# EAGLE design IV_Swinger_2_ss_mod (EAGLE 9.2.1)
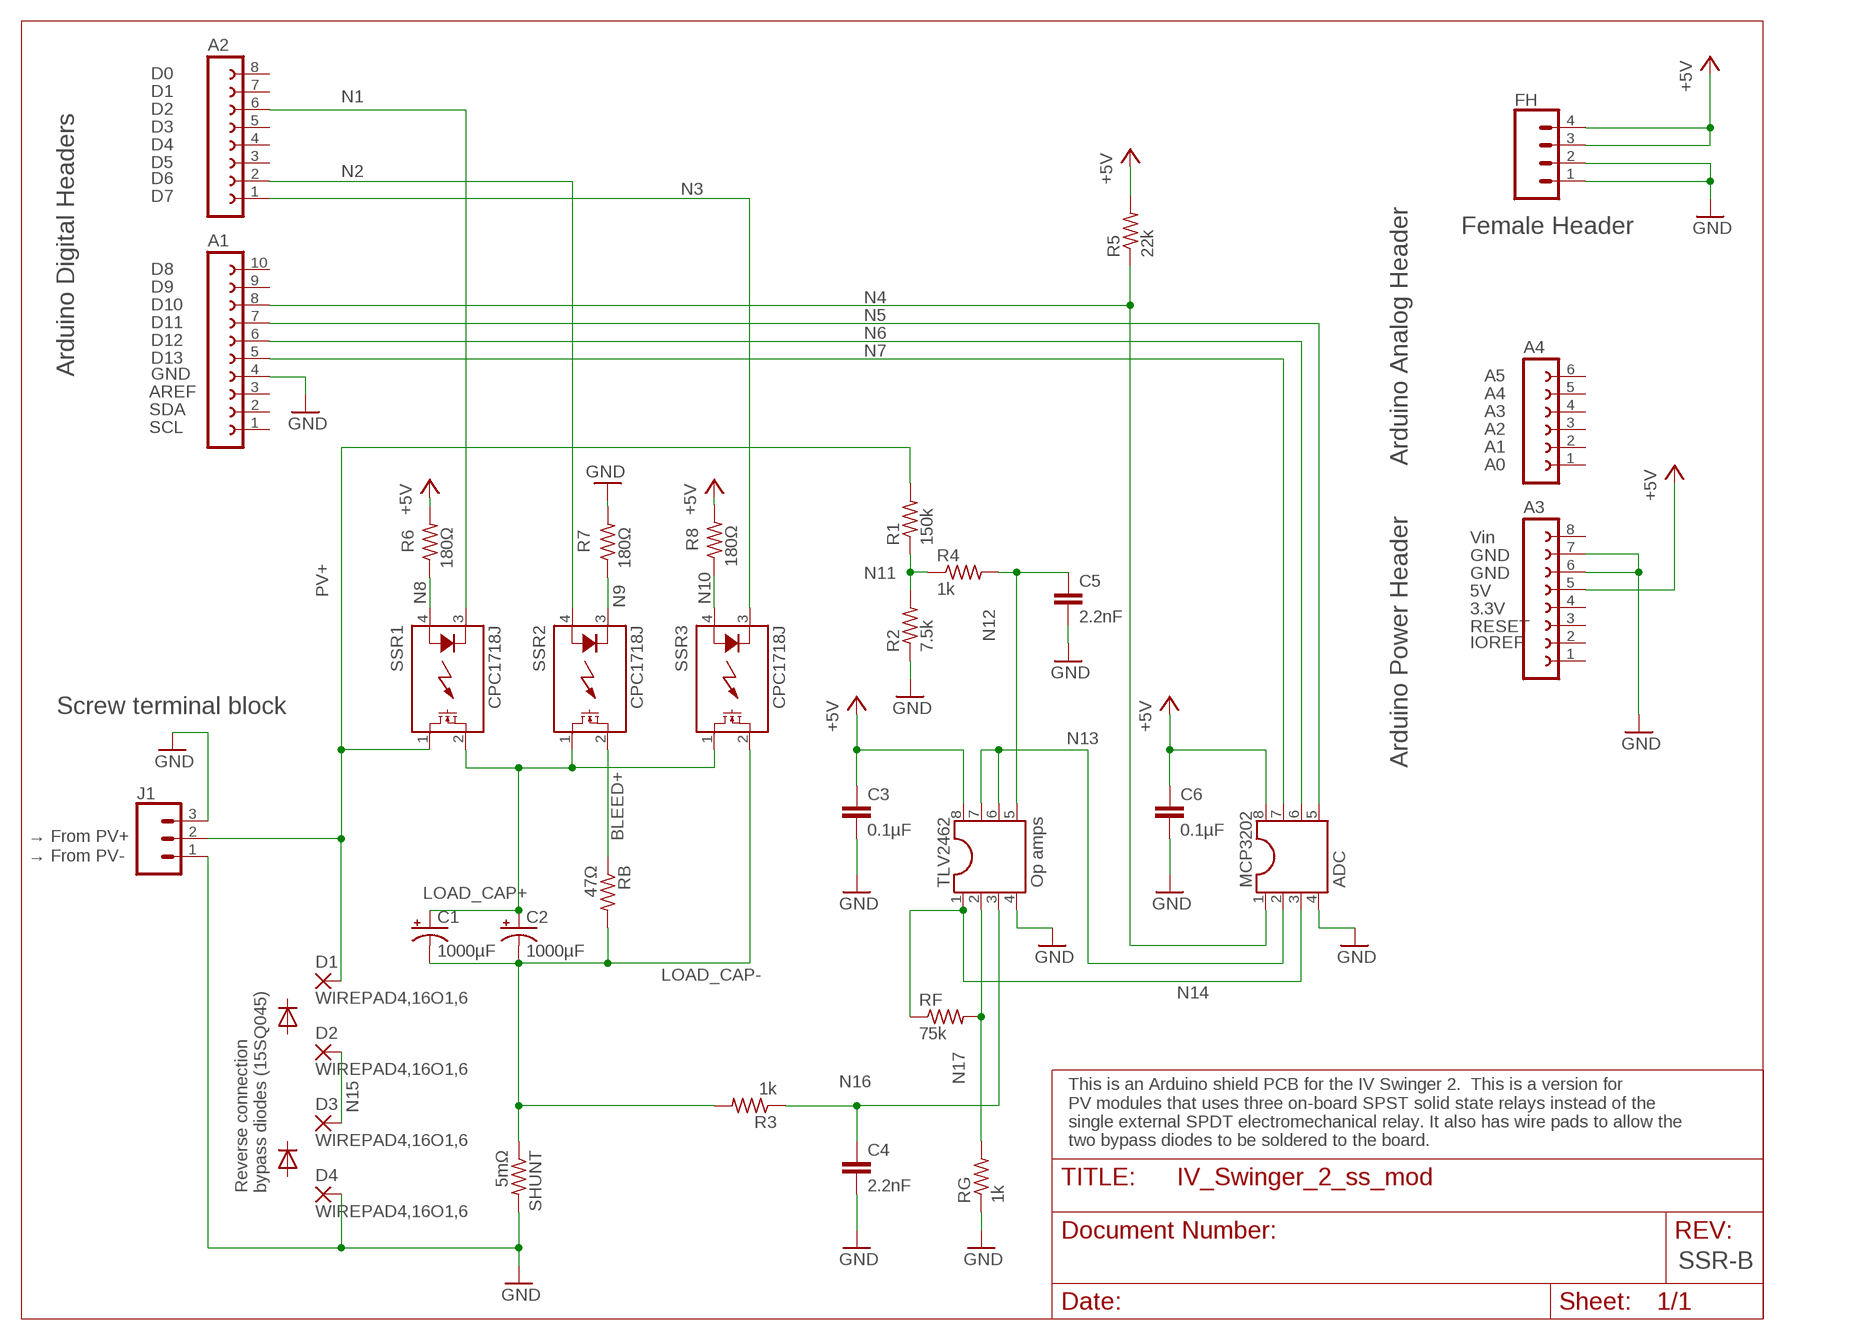
[diagram p0: schematic, sheet 1]

## Parts
A1  FE10-1  [FE10]
A2  FE08-1  [FE08]
A3  FE08-1  [FE08]
A4  FE06-1  [FE06]
C1  1000µF  CPOL-USE7.5-18  [E7,5-18]
C2  1000µF  CPOL-USE7.5-18  [E7,5-18]
C3  0.1µF  C-EU025-030X050  [C025-030X050]
C4  2.2nF  C-EU025-030X050  [C025-030X050]
C5  2.2nF  C-EU025-030X050  [C025-030X050]
C6  0.1µF  C-EU025-030X050  [C025-030X050]
D1  WIREPAD4,16O1,6  [4,16O1,6]
D2  WIREPAD4,16O1,6  [4,16O1,6]
D3  WIREPAD4,16O1,6  [4,16O1,6]
D4  WIREPAD4,16O1,6  [4,16O1,6]
FH  CONN_04LONGPADS  [1X04_LONGPADS]
J1  CONN_03-SCREW-5MM  [SCREWTERMINAL-5MM-3]
MCP3202  ADC  DIL8S  [SOCKET-08]
R1  150k  R-US_0207/10  [0207/10]
R2  7.5k  R-US_0207/10  [0207/10]
R3  1k  R-US_0207/10  [0207/10]
R4  1k  R-US_0207/10  [0207/10]
R5  22k  R-US_0207/10  [0207/10]
R6  180Ω  R-US_0207/10  [0207/10]
R7  180Ω  R-US_0207/10  [0207/10]
R8  180Ω  R-US_0207/10  [0207/10]
RB  47Ω  R-US_0817/7V  [P0817V]
RF  75k  R-US_0207/10  [0207/10]
RG  1k  R-US_0207/10  [0207/10]
SHUNT  5mΩ  R-US_0617/5V  [0617V]
SSR1  CPC1718J  [I4-PAC]
SSR2  CPC1718J  [I4-PAC]
SSR3  CPC1718J  [I4-PAC]
TLV2462  Op amps  DIL8S  [SOCKET-08]

## Nets
+5V: A3.5 C3.1 C6.1 FH.3 FH.4 MCP3202.8 R5.2 R6.2 R8.2 TLV2462.8
BLEED+: RB.1 SSR2.2(DS2)
GND: A1.4 A3.6 A3.7 C3.2 C4.2 C5.2 C6.2 D4.1(P) FH.1 FH.2 J1.1 J1.3 MCP3202.4 R2.1 R7.2 RG.1 SHUNT.2 TLV2462.4
LOAD_CAP+: C1.+ C2.+ SSR1.2(DS2) SSR2.1(DS1) SSR3.1(DS1)
LOAD_CAP-: C1.- C2.- R3.2 RB.2 SHUNT.1 SSR3.2(DS2)
N1: A2.6 SSR1.3(K)
N2: A2.2 SSR2.4(A)
N3: A2.1 SSR3.3(K)
N4: A1.8 MCP3202.1 R5.1
N5: A1.7 MCP3202.5
N6: A1.6 MCP3202.6
N7: A1.5 MCP3202.7
N8: R6.1 SSR1.4(A)
N9: R7.1 SSR2.3(K)
N10: R8.1 SSR3.4(A)
N11: R1.1 R2.2 R4.1
N12: C5.1 R4.2 TLV2462.5
N13: MCP3202.2 TLV2462.6 TLV2462.7
N14: MCP3202.3 RF.1 TLV2462.1
N15: D2.1(P) D3.1(P)
N16: C4.1 R3.1 TLV2462.3
N17: RF.2 RG.2 TLV2462.2
PV+: D1.1(P) J1.2 R1.2 SSR1.1(DS1)
Unconnected: A1.1 A1.2 A1.3 A1.9 A1.10 A2.3 A2.4 A2.5 A2.7 A2.8 A3.1 A3.2 A3.3 A3.4 A3.8 A4.1 A4.2 A4.3 A4.4 A4.5 A4.6

## Notes on the sheet
- D0
- D1
- D2
- D3
- D4
- D5
- D6
- D7
- Female Header
- D8
- D9
- D10
- D11
- D12
- D13
- Arduino Digital Headers | GND
- A5
- AREF | A4
- SDA | A3
- SCL | A2
- A1
- Arduino Analog Header
- A0
- Vin
- GND
- GND
- 5V
- 3.3V
- RESET
- IOREF
- Screw terminal block
- Arduino Power Header
- → From PV+
- → From PV-
- This is an Arduino shield PCB for the IV Swinger 2.  This is a version for 
  PV modules that uses three on-board SPST solid state relays instead of the 
  single external SPDT electromechanical relay. It also has wire pads to allow the 
  two bypass diodes to be soldered to the board.
- Reverse connection
  bypass diodes (15SQ045)
- SSR-B

## Library data of the parts
A1 = con-lsta:FE10-1: FEMALE HEADER; OC_FARNELL: unknown; OC_NEWARK: unknown
A2 A3 = con-lsta:FE08-1: FEMALE HEADER; OC_FARNELL: unknown; OC_NEWARK: unknown
A4 = con-lsta:FE06-1: FEMALE HEADER; OC_FARNELL: unknown; OC_NEWARK: unknown
C1 C2 = rcl:CPOL-US: POLARIZED CAPACITOR, American symbol; SPICEPREFIX: C
C3-C6 = rcl:C-EU: CAPACITOR, European symbol; SPICEPREFIX: C
D1 = wirepad:WIREPAD: Wire PAD connect wire on PCB; SPICEPREFIX: X
D2-D4 = wirepad:WIREPAD: Wire PAD connect wire on PCB
FH = my_connectors:CONN_04: Multi connection point. Often used as Generic Header-pin footprint for 0.1 inch spaced/style header connections On any of the 0.1 inch spaced packages, you can populate with these: Break Away Headers - Straight <https://www.sparkfun.com/products/116> (PRT-00116) Break Away Male Headers - Right Angle <https://www.sparkfun.com/products/553> (PRT-00553) Female Headers <https://www.sparkfun.com/products/115> (PRT-00115) Break Away Headers - Machine Pin <https://www.sparkfun.com/products/117> (PRT-00117) Break Away Female Headers - Swiss Machine Pin <https://www.sparkfun.com/products/743> (PRT-00743) For SCREWTERMINALS and SPRING TERMINALS visit here: Screw Terimnals on SparkFun.com <https://www.sparkfun.com/search/results?term=Screw+Terminals> (5mm/3.5mm/2.54mm spacing) This device is also useful as a general connection point to wire up your design to another part of your project. Our various solder wires solder well into these plated through hole pads. Hook-Up Wire - Assortment (Stranded, 22 AWG) <https://www.sparkfun.com/products/11375> (PRT-11375) Hook-Up Wire - Assortment (Solid Core, 22 AWG) <https://www.sparkfun.com/products/11367> (PRT-11367) View the entire wire category on our website here <https://www.sparkfun.com/categories/141> Special notes: Molex polarized connector foot print use with SKU : PRT-08231 with associated crimp pins and housings. 1MM SMD Version SKU: PRT-10208; PROD_ID: CONN-09696
J1 = SparkFun-Connectors:CONN_03: Multi connection point. Often used as Generic Header-pin footprint for 0.1 inch spaced/style header connections On any of the 0.1 inch spaced packages, you can populate with these: Break Away Headers - Straight <https://www.sparkfun.com/products/116> (PRT-00116) Break Away Male Headers - Right Angle <https://www.sparkfun.com/products/553> (PRT-00553) Female Headers <https://www.sparkfun.com/products/115> (PRT-00115) Break Away Headers - Machine Pin <https://www.sparkfun.com/products/117> (PRT-00117) Break Away Female Headers - Swiss Machine Pin <https://www.sparkfun.com/products/743> (PRT-00743) Stackable Header - 3 Pin (Female, 0.1") <https://www.sparkfun.com/products/13875> (PRT-13875) For SCREWTERMINALS and SPRING TERMINALS visit here: Screw Terimnals on SparkFun.com <https://www.sparkfun.com/search/results?term=Screw+Terminals> (5mm/3.5mm/2.54mm spacing) This device is also useful as a general connection point to wire up your design to another part of your project. Our various solder wires solder well into these plated through hole pads. Hook-Up Wire - Assortment (Stranded, 22 AWG) <https://www.sparkfun.com/products/11375> (PRT-11375) Hook-Up Wire - Assortment (Solid Core, 22 AWG) <https://www.sparkfun.com/products/11367> (PRT-11367) View the entire wire category on our website here <https://www.sparkfun.com/categories/141> Special notes: Molex polarized connector foot print use with SKU : PRT-08232 with associated crimp pins and housings.; PROD_ID: CONN-10134; SF_SKU: PRT-08433
MCP3202 TLV2462 = ic-package:DIL8: Dual In Line / Socket
R1-R8 RB RF RG SHUNT = rcl:R-US_: RESISTOR, American symbol; SPICEPREFIX: R
SSR1-SSR3 = my_relay:CPC1718J: Single-Pole, Normally Open i4-PAC (TM) DC Power Relay Source: Data sheet <http://www.ixysic.com/home/pdfs.nsf/www/CPC1718.pdf/$file/CPC1718.pdf>

## Board
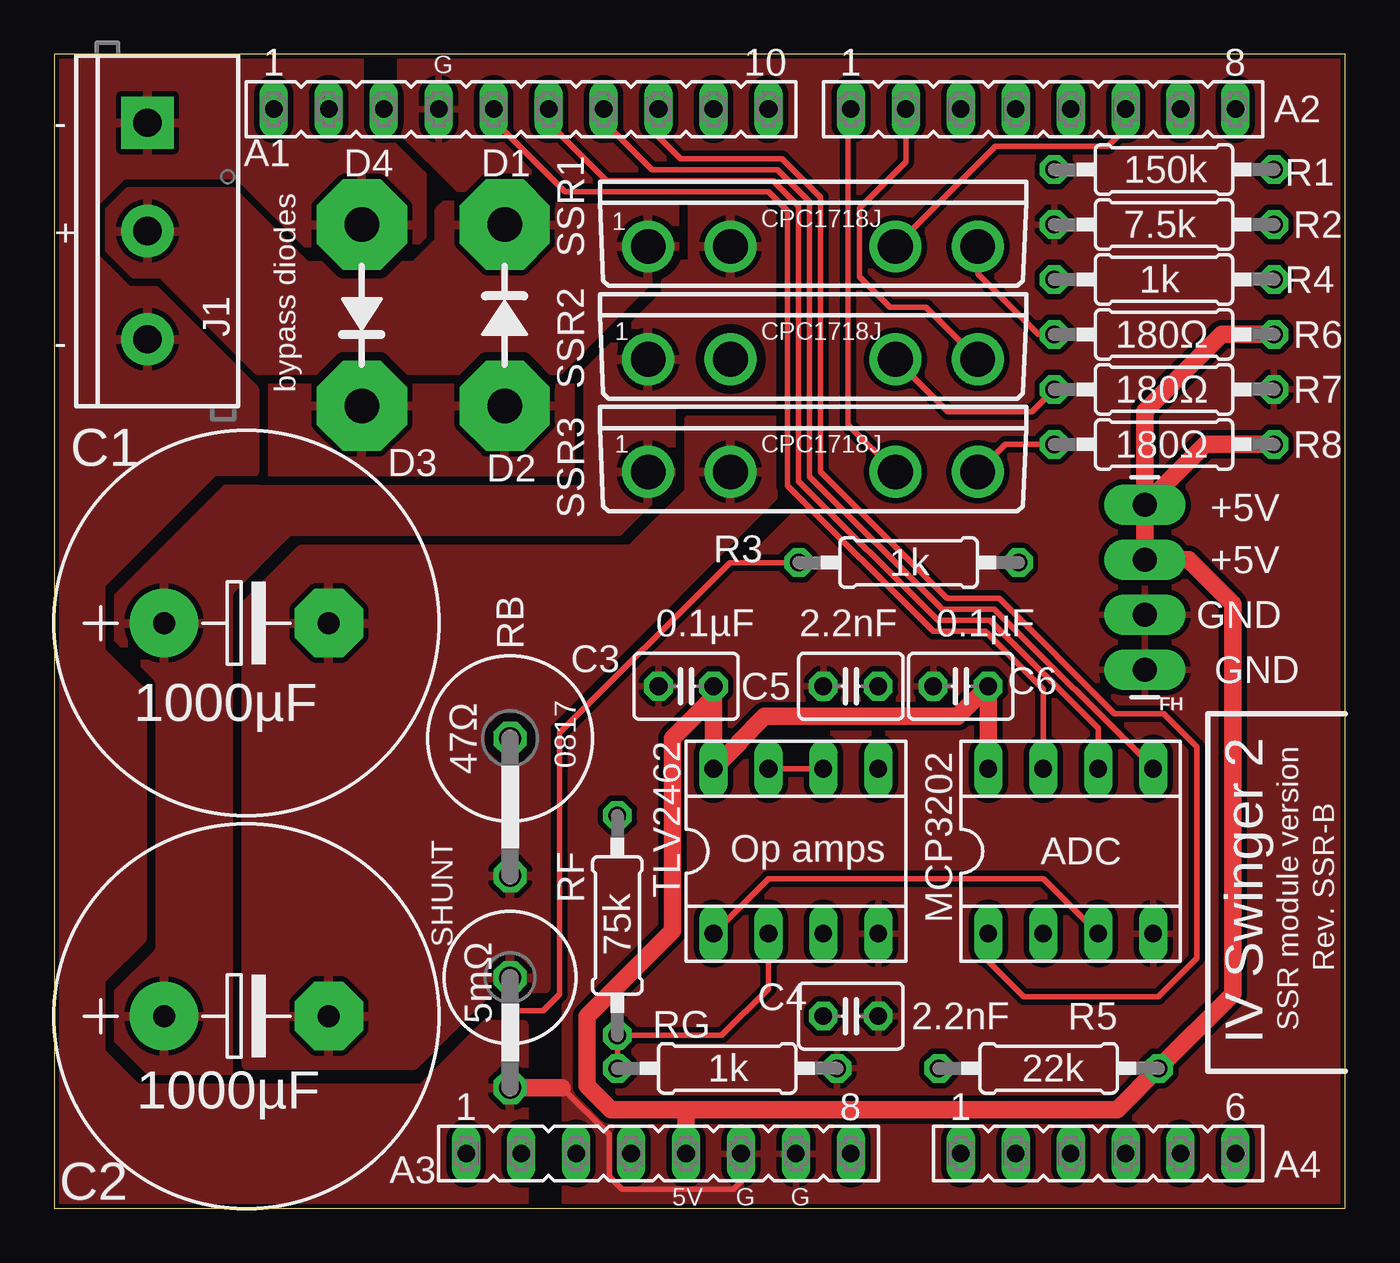
[diagram p1: board, top side]
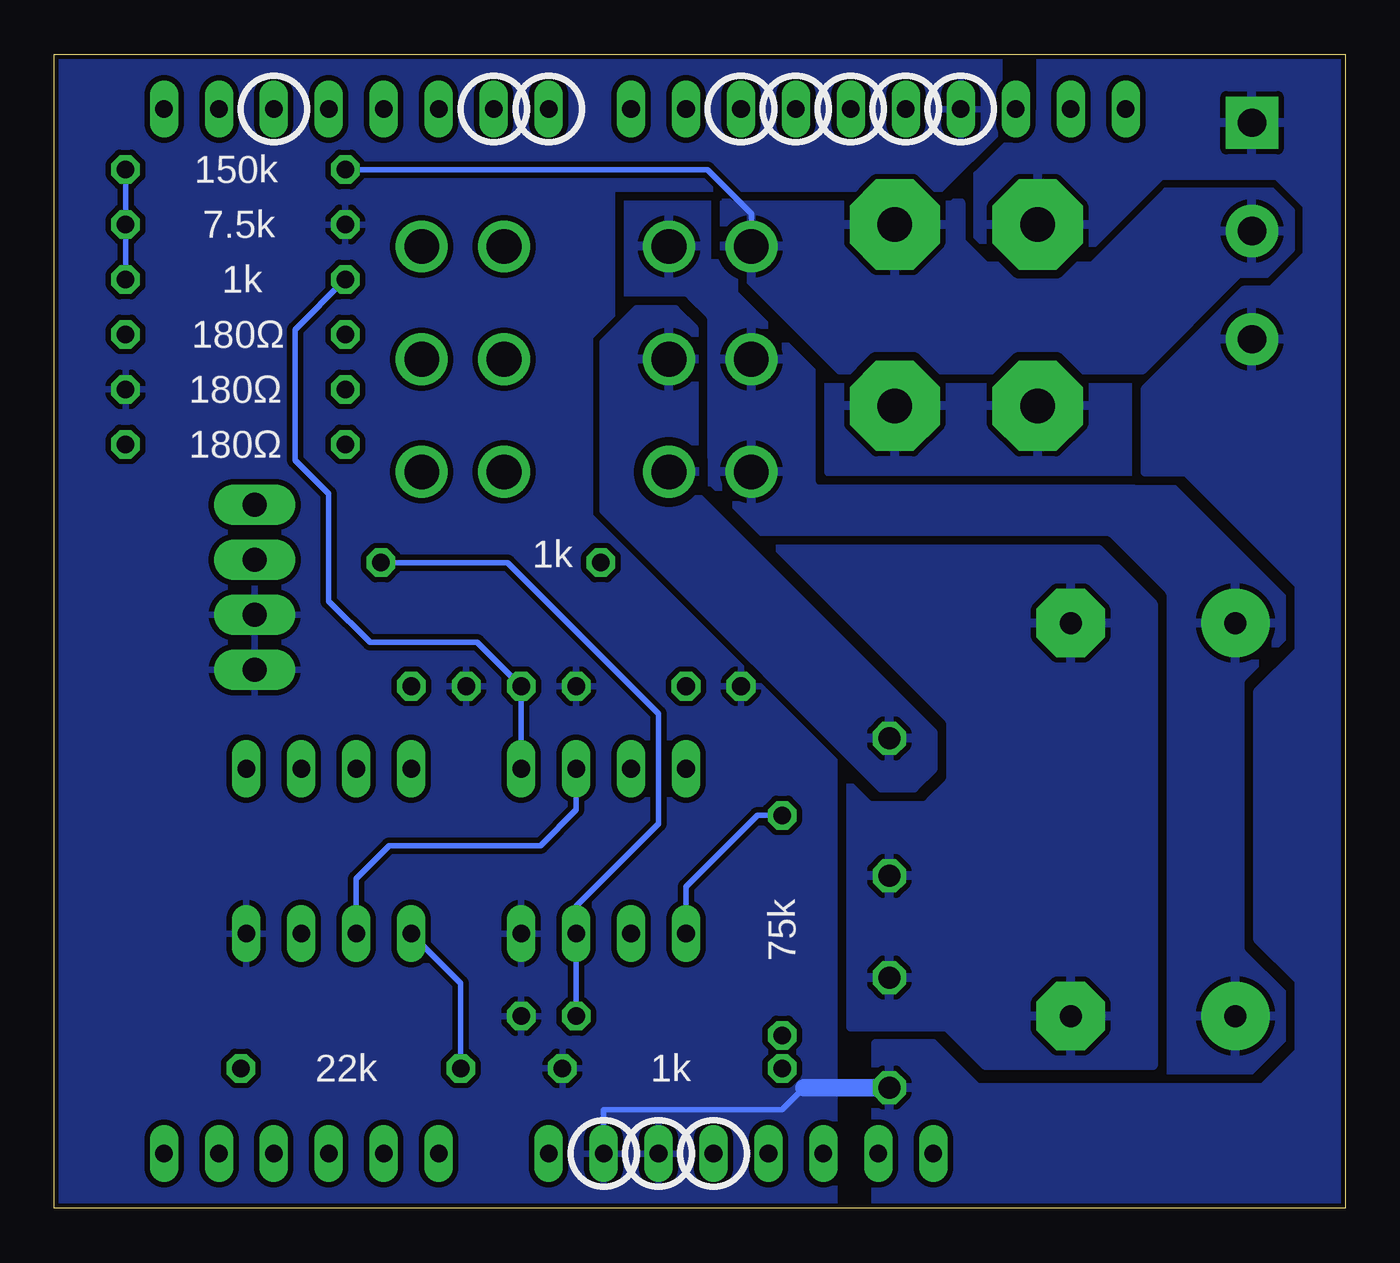
[diagram p2: board, bottom side, seen from below]

Size 59.69 x 53.34 mm. Coordinates in mm from the lower left corner, seen from the top.
Outline: 0,0 59.69,0 59.69,53.34 0,53.34 0,0
Copper layers (1*16): Top 0.035mm / dielectric 1.5mm / Bottom 0.035mm
Design rules "SparkFun-2-layer-STANDARD": minimum track width 10mil, minimum drill 20mil, track to track 10mil, track to pad 8mil, pad to pad 8mil, via to via 10mil, smd to smd 8mil, copper to edge 8mil, drill to drill 8mil, minimum pad ring 10mil, minimum via ring 10mil, stop-mask expansion 4mil, vias tented up to drill 25mil, thermal gap 10mil

### Footprints (pad centres in the part's own frame; a part is rotated, then mirrored left to right if it is on the bottom)
FE10 = drill 0.813 long: 1 -11.43,0; 2 -8.89,0; 3 -6.35,0; 4 -3.81,0; 5 -1.27,0; 6 1.27,0; 7 3.81,0; 8 6.35,0; 9 8.89,0; 10 11.43,0
FE08 = drill 0.813 long: 1 -8.89,0; 2 -6.35,0; 3 -3.81,0; 4 -1.27,0; 5 1.27,0; 6 3.81,0; 7 6.35,0; 8 8.89,0
FE06 = drill 0.813 long: 1 -6.35,0; 2 -3.81,0; 3 -1.27,0; 4 1.27,0; 5 3.81,0; 6 6.35,0
E7,5-18 = drill 1.016 pad 3.15: + -3.81,0 | drill 1.016 pad 3.15 octagon: - 3.81,0
C025-030X050 = drill 0.813 octagon: 1 -1.27,0; 2 1.27,0
4,16O1,6 = drill 1.6 pad 4.166 octagon: 1 0,0
1X04_LONGPADS = drill 1.118 pad 1.88 long: 1 0,0; 2 2.54,0; 3 5.08,0; 4 7.62,0
SCREWTERMINAL-5MM-3 = drill 1.3 pad 2.413 square: 1 0,0 | drill 1.3 pad 2.413: 2 5,0; 3 10,0
SOCKET-08 = drill 0.813 long: 1 -3.81,-3.81; 2 -1.27,-3.81; 3 1.27,-3.81; 4 3.81,-3.81; 5 3.81,3.81; 6 1.27,3.81; 7 -1.27,3.81; 8 -3.81,3.81
0207/10 = drill 0.813 octagon: 1 -5.08,0; 2 5.08,0
P0817V = drill 1.016 octagon: 1 -5.08,0; 2 1.27,0
0617V = drill 1.016 octagon: 1 -2.54,0; 2 2.54,0
I4-PAC = drill 1.6 pad 2.3: 1 -7.62,0; 2 -3.81,0; 3 3.81,0; 4 7.62,0

### Placement (x,y rotation side)
A1  21.59,50.8 0 top
A2  45.72,50.8 0 top
A3  27.94,2.54 0 top
A4  48.26,2.54 0 top
C1  8.89,27.05 0 top
C2  8.89,8.89 0 top
C3  29.21,24.13 180 top
C4  36.83,8.89 0 top
C5  36.83,24.13 180 top
C6  41.91,24.13 180 top
D1  20.83,45.47 0 top
D2  20.83,37.08 0 top
D3  14.22,37.08 0 top
D4  14.22,45.47 0 top
FH  50.42,24.89 90 top
J1  4.32,50.16 270 top
MCP3202  46.99,16.51 0 top
R1  51.31,48.01 180 top
R2  51.31,45.47 0 top
R3  39.5,29.84 180 top
R4  51.31,42.93 180 top
R5  45.97,6.48 0 top
R6  51.31,40.39 0 top
R7  51.31,37.85 0 top
R8  51.31,35.31 0 top
RB  21.08,16.64 270 top
RF  26.04,13.08 270 top
RG  31.11,6.48 180 top
SHUNT  21.08,8.13 270 top
SSR1  35.08,44.45 0 top
SSR2  35.08,39.24 0 top
SSR3  35.08,34.04 0 top
TLV2462  34.29,16.51 0 top

### Tracks (layer width: path | path; a pad name or v marks a point on that pad's centre or on a via)
+5V
  Top 0.813: FH.4 FH.3 52.45,29.97 54.48,27.94 54.48,9.91 R5.2 49.15,4.57 29.21,4.57 | 29.21,4.57 25.75,4.57 24.64,5.68 24.64,8.89 28.57,12.83 28.57,21.72 30.48,23.62 C3.1 TLV2462.8 31.65,21.49 31.65,21.55 32.83,22.73 41.78,22.73 C6.1 MCP3202.8 | A3.5 29.21,4.57 | R8.2 53.21,35.31 FH.4 | R6.2 53.98,40.39 50.42,36.83 FH.4
BLEED+
  pour Bottom (isolate 0.406): 30.99,41.53 32.77,41.53 34.29,40.01 34.29,32.26 21.46,19.43 19.94,19.43 19.05,20.32 19.05,21.97 30.1,33.02 30.1,40.64
GND
  Top 0.254: 23.49,5.59 25.68,3.4 25.68,1.47 26.26,0.89 31.4,0.89 31.75,1.24 A3.6
  Top 0.813: SHUNT.2 23.49,5.59
  Bottom 0.254: 25.02,5.59 26.04,4.57 34.29,4.57 A3.7
  Bottom 0.813: SHUNT.2 25.02,5.59
  pour Bottom: 16,53.34 16,49.78 18.67,47.12 33.91,47.12 33.91,41.27 34.92,40.26 34.92,32 23.62,20.7 23.62,0 59.69,0 59.69,53.34
  pour Bottom (rank 2): 21.72,0 0,0 0,53.34 14.1,53.34 14.1,50.67 17.02,47.75 17.02,44.96 16.38,44.32 11.94,44.32 8.51,47.75 3.17,47.75 1.78,46.35 1.78,44.07 3.43,42.42 4.7,42.42 9.27,37.85 9.27,34.04 7.37,34.04 2.16,28.83 2.16,25.78 4.06,23.88 4.06,12.45 2.16,10.54 2.16,7.24 3.81,5.59 17.02,5.59 19.05,7.62 21.72,7.62
  pour Top (rank 2): 21.72,0 0,0 0,53.34 14.1,53.34 14.1,50.67 17.02,47.75 17.02,44.96 16.38,44.32 11.94,44.32 8.51,47.75 3.17,47.75 1.78,46.35 1.78,44.07 3.43,42.42 4.7,42.42 9.27,37.85 9.27,34.04 7.37,34.04 2.16,28.83 2.16,25.78 4.06,23.88 4.06,12.45 2.16,10.54 2.16,7.24 3.81,5.59 17.02,5.59 19.94,8.51 21.72,8.51
  pour Top: 16,53.34 16,49.78 18.67,47.12 33.91,47.12 33.91,41.27 34.92,40.26 34.92,32.77 23.62,21.46 23.62,0 59.69,0 59.69,53.34
LOAD_CAP+
  pour Top (isolate 0.406, rank 4): 7.37,34.04 2.16,28.83 2.16,25.78 4.06,23.88 4.06,12.45 2.16,10.54 2.16,7.24 3.81,5.59 8.89,5.59 8.89,27.94 11.43,30.48 26.67,30.48 29.21,33.02 29.21,36.45 33.91,36.45 33.91,46.23 28.7,46.23 28.7,44.07 23.88,39.24 23.88,34.04
  pour Bottom (isolate 0.406, rank 4): 7.37,34.04 2.16,28.83 2.16,25.78 4.06,23.88 4.06,12.45 2.16,10.54 2.16,7.24 3.81,5.59 8.89,5.59 8.89,27.94 11.43,30.48 27.56,30.48 30.1,33.02 30.1,37.34 33.91,41.15 33.91,46.48 28.7,46.48 28.7,44.07 23.88,39.24 23.88,34.04
LOAD_CAP-
  Top 0.254: SHUNT.1 21.08,9.14 22.61,9.14 23.37,9.91 23.37,21.98 31.24,29.84 R3.2
  pour Bottom (isolate 0.406, rank 2): 8.89,6.6 16.64,6.6 18.41,8.38 22.86,8.38 22.86,20.83 34.29,32.26 34.29,36.45 30.1,36.45 30.1,33.02 27.56,30.48 11.43,30.48 8.89,27.94
  pour Top (isolate 0.406, rank 2): 11.43,30.48 26.67,30.48 29.34,33.15 29.34,36.45 34.92,36.45 34.92,34.54 22.73,22.35 22.73,10.16 20.19,10.16 16.64,6.6 8.89,6.6 8.89,27.94
N1
  Top 0.254: A2.6 49.53,49.91 48.71,49.08 43.52,49.08 SSR1.3
N2
  Top 0.254: A2.2 39.37,48.37 37.23,46.23 37.23,43.05 38.63,41.65 40.29,41.65 SSR2.4
N3
  Top 0.254: A2.1 36.7,50.67 36.7,36.22 SSR3.3
N4
  Top 0.254: A1.8 27.94,49.53 28.96,48.51 33.65,48.51 35.43,46.73 35.43,34.04 41.27,28.19 43.68,28.19 49.02,22.86 51.31,22.86 52.83,21.34 52.83,11.56 51.05,9.78 44.83,9.78 43.18,11.43 MCP3202.1
  Bottom 0.254: R5.1 40.89,10.41 MCP3202.1
N5
  Top 0.254: A1.7 25.4,50.25 27.64,48.01 33.44,48.01 34.92,46.52 34.92,33.82 41.06,27.69 43.47,27.69 50.8,20.36 MCP3202.5
N6
  Top 0.254: A1.6 22.86,50.16 25.53,47.5 33.23,47.5 34.42,46.31 34.42,33.61 40.85,27.18 43.26,27.18 48.26,22.18 MCP3202.6
N7
  Top 0.254: A1.5 20.32,50.29 23.62,46.99 33.02,46.99 33.91,46.1 33.91,33.4 40.64,26.67 43.05,26.67 45.72,24 MCP3202.7
N8
  Top 0.254: R6.1 45.49,40.39 42.7,43.18 SSR1.4
N9
  Top 0.254: R7.1 45.21,36.82 41.31,36.82 SSR2.3
N10
  Top 0.254: R8.1 43.97,35.31 SSR3.4
N11
  Bottom 0.254: R1.1 R2.2 R4.1
N12
  Bottom 0.254: R4.2 48.55,40.61 48.55,34.58 46.99,33.02 46.99,28.07 45.09,26.16 40.13,26.16 C5.1 TLV2462.5
N13
  Top 0.254: TLV2462.7 TLV2462.6
  Bottom 0.254: TLV2462.6 35.56,18.41 37.21,16.76 44.2,16.76 45.72,15.24 MCP3202.2
N14
  Top 0.254: TLV2462.1 33.02,15.24 45.72,15.24 MCP3202.3
  Bottom 0.254: RF.1 27.18,18.16 30.48,14.86 TLV2462.1
N15
  pour Top (isolate 0.406, rank 3): 9.27,38.73 9.27,34.04 23.88,34.04 23.88,38.73
  pour Bottom (isolate 0.406, rank 3): 9.27,38.73 9.27,34.04 23.88,34.04 23.88,38.73
N16
  Bottom 0.254: C4.1 TLV2462.3 35.56,13.97 31.75,17.78 31.75,22.86 38.73,29.84 R3.1
N17
  Top 0.254: TLV2462.2 33.02,10.16 30.86,8 RF.2 RG.2
PV+
  Bottom 0.254: R1.2 29.49,48.01 27.46,45.97 SSR1.1
  pour Top (isolate 0.406, rank 2): 2.54,46.1 2.54,44.32 3.68,43.18 4.95,43.18 9.4,38.73 23.37,38.73 28.7,44.07 28.7,46.23 23.62,46.23 23.37,46.48 18.16,46.48 17.78,46.1 17.78,44.7 16.64,43.56 11.68,43.56 8.26,46.99 3.43,46.99
  pour Bottom (isolate 0.406, rank 2): 2.54,46.1 2.54,44.32 3.68,43.18 4.95,43.18 9.4,38.73 23.37,38.73 28.7,44.07 28.7,46.48 17.78,46.48 17.78,44.7 16.64,43.56 11.68,43.56 8.26,46.99 3.43,46.99

### Text on the board
tPlace: G | - | 1 | + | 1 | - | bypass diodes | 1 | +5V | +5V | GND | GND | Rev. SSR-B | IV Swinger 2 | SSR module version | 5V | G | G
bPlace: 150k | 7.5k | 1k | 180Ω | 180Ω | 180Ω | 1k | 75k | 1k | 22k